# EAGLE design BI16_short (EAGLE 7.5.0)

## Sheet 1 of 2
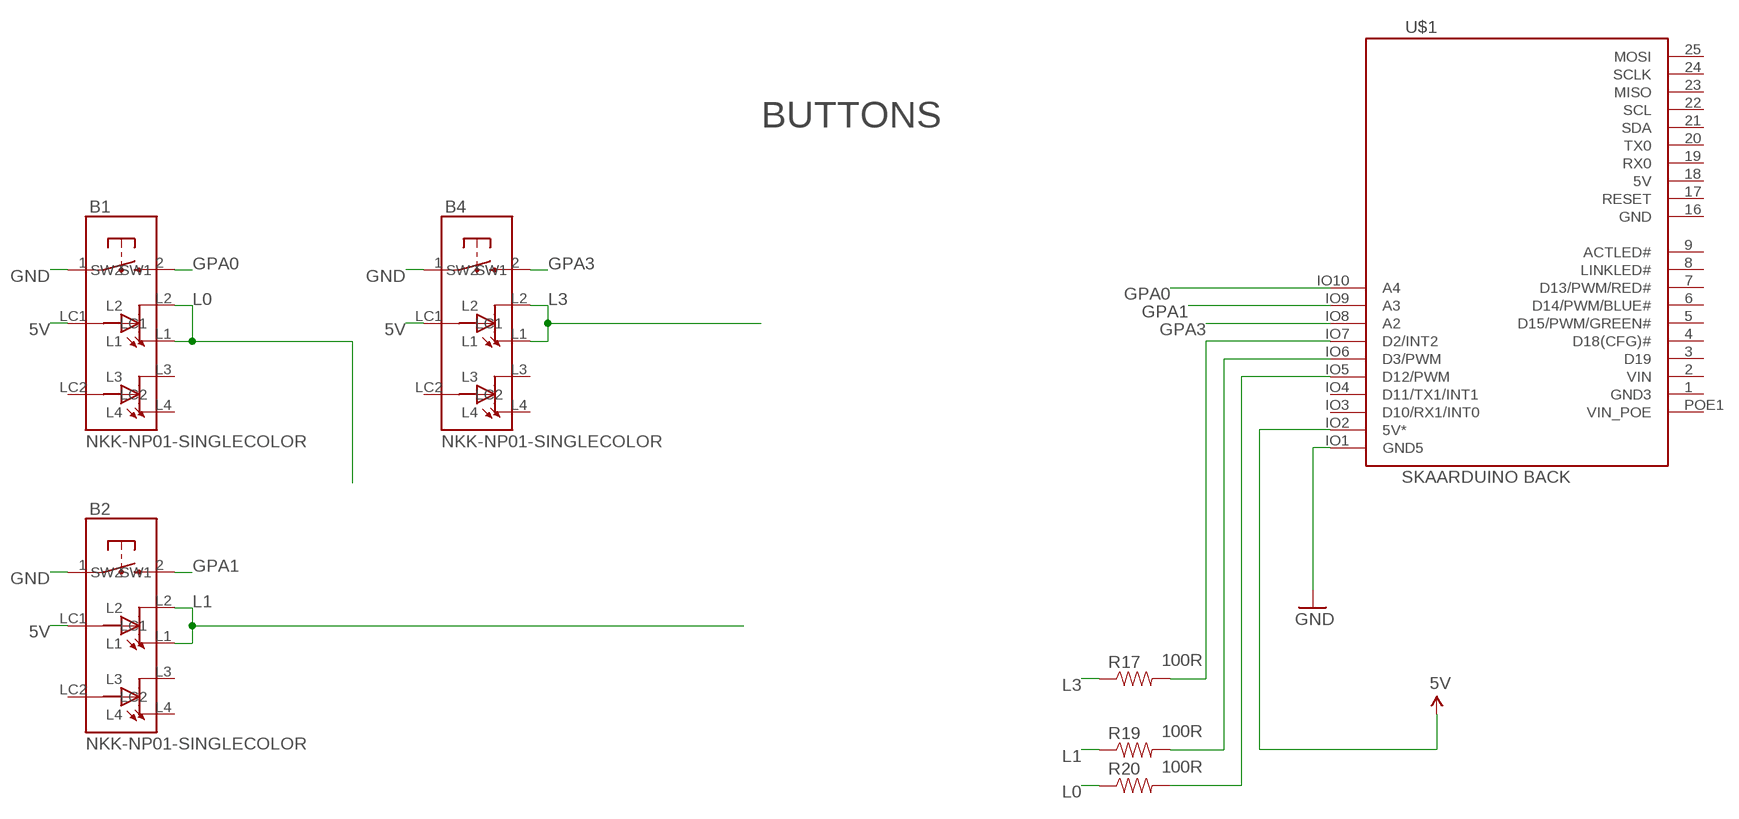
[diagram p0: schematic, sheet 1]

### Parts
B1  NKK-NP01-SINGLECOLOR  [NKK-NP01]
B2  NKK-NP01-SINGLECOLOR  [NKK-NP01]
B4  NKK-NP01-SINGLECOLOR  [NKK-NP01]
R17  100R  RESISTOR0603-RES  [0603-RES]
R19  100R  RESISTOR0603-RES  [0603-RES]
R20  100R  RESISTOR0603-RES  [0603-RES]
U$1  SKAARDUINO_BACK_EDGECON  [SKAARDUINO_BACK_PTH_EDGECON]

### Nets
5V [Power]: B1.LC1 B2.LC1 B4.LC1 U$1.IO2(5V*)
GND [Power]: B1.1(SW1) B2.1(SW1) B4.1(SW1) U$1.IO1(GND5)
GPA0: B1.2(SW2) U$1.IO10(A4)
GPA1: B2.2(SW2) U$1.IO9(A3)
GPA3: B4.2(SW2) U$1.IO8(A2)
L0: B1.L1 B1.L2 R20.1
L1: B2.L1 B2.L2 R19.1
L3: B4.L1 B4.L2 R17.1
N$10: R17.2 U$1.IO7(D2/INT2)
N$12: R19.2 U$1.IO6(D3/PWM)
N$19: R20.2 U$1.IO5(D12/PWM)
Unconnected: B1.L3 B1.L4 B1.LC2 B2.L3 B2.L4 B2.LC2 B4.L3 B4.L4 B4.LC2 U$1.3(D19) U$1.4(D18(CFG)#) U$1.5(D15/PWM/GREEN#) U$1.6(D14/PWM/BLUE#) U$1.7(D13/PWM/RED#) U$1.8(LINKLED#) U$1.9(ACTLED#) U$1.17(RESET) U$1.19(RX0) U$1.20(TX0) U$1.21(SDA) U$1.22(SCL) U$1.23(MISO) U$1.24(SCLK) U$1.25(MOSI) U$1.IO3(D10/RX1/INT0) U$1.IO4(D11/TX1/INT1)

### Notes on the sheet
- BUTTONS

## Sheet 2 of 2

## Power pins joined to a net without a drawn wire
5V: U$1.18(5V)
GND: U$1.16(GND)
GND3: U$1.1(GND3)
VIN: U$1.2(VIN)
VIN_POE: U$1.POE1(VIN_POE)

## Library data of the parts
B1 B2 B4 = SKAARHOJ:NKK-NP01-SINGLECOLOR
R17 R19 R20 = SparkFun:RESISTOR: Resistor Basic schematic elements and footprints for 0603, 1206, and PTH resistors.
U$1 = SKAARHOJ:SKAARDUINO_BACK_EDGECON

## Net classes
0 default: width 0.203 mm, drill 0.305 mm, clearance 0.152 mm
1 Power: width 0.406 mm, drill 0.61 mm, clearance 0.203 mm

## Board
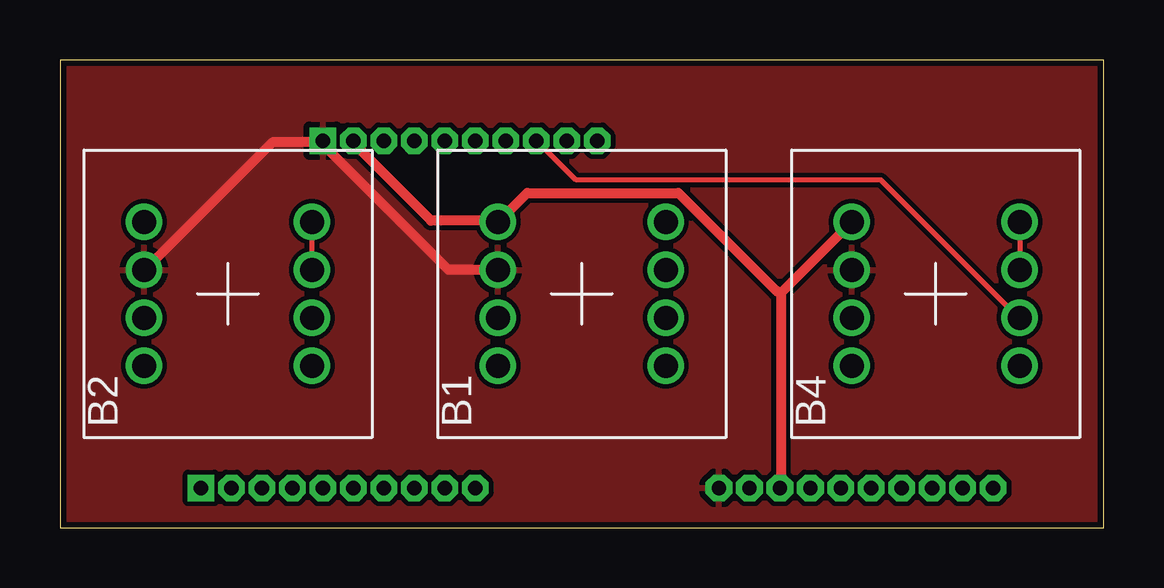
[diagram p1: board, top side]
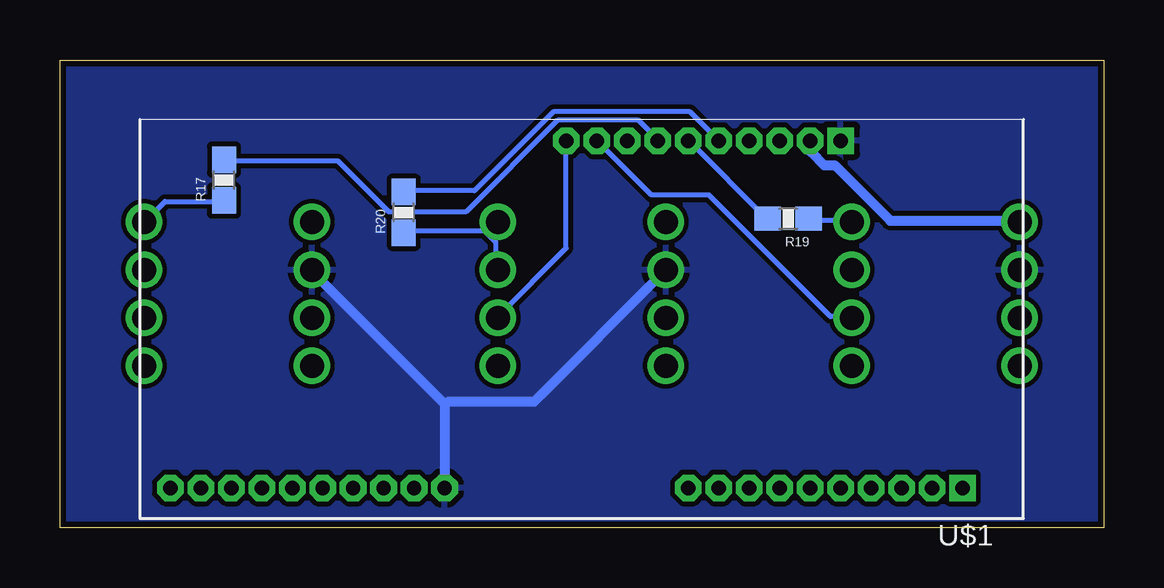
[diagram p2: board, bottom side, seen from below]

Size 43.5 x 19.5 mm. Coordinates in mm from the lower left corner, seen from the top.
Outline: 0,0 43.5,0 43.5,19.5 0,19.5 0,0
Copper layers (1*16): Top 0.035mm / dielectric 1.5mm / Bottom 0.035mm
Design rules "Fusion_eagle_rule_v1.1": minimum track width 6mil, minimum drill 12mil, track to track 6mil, track to pad 6mil, pad to pad 6mil, via to via 6mil, smd to smd 0mil, copper to edge 10mil, drill to drill 10mil, minimum pad ring 10mil, minimum via ring 6mil, stop-mask expansion 2mil, vias tented up to drill 100mil, thermal gap 10mil

### Footprints (pad centres in the part's own frame; a part is rotated, then mirrored left to right if it is on the bottom)
NKK-NP01 = drill 1: 1 1,3.5; 2 -1,-3.5; L1 3,-3.5; L2 1,-3.5; L3 -1,3.5; L4 -3,3.5; LC1 3,3.5; LC2 -3,-3.5
0603-RES = smd 1.1 x 1: 1 -0.85,0; 2 0.85,0
SKAARDUINO_BACK_PTH_EDGECON = drill 0.6 pad 1.016 octagon: 1 2.159,3.81; 2 2.159,5.08; 3 2.159,6.35; 4 2.159,7.62; 5 2.159,8.89; 6 2.159,10.16; 7 2.159,11.43; 8 2.159,12.7; 9 2.159,13.97; 16 2.159,24.13; 17 2.159,25.4; 18 2.159,26.67; 19 2.159,27.94; 20 2.159,29.21; 21 2.159,30.48; 22 2.159,31.75; 23 2.159,33.02; 24 2.159,34.29; 25 2.159,35.56; IO2 16.637,8.89; IO3 16.637,10.16; IO4 16.637,11.43; IO5 16.637,12.7; IO6 16.637,13.97; IO7 16.637,15.24; IO8 16.637,16.51; IO9 16.637,17.78; IO10 16.637,19.05 | drill 0.6 pad 1.016 square: IO1 16.637,7.62; POE1 2.159,2.54

### Placement (x,y rotation side)
B1  21.75,9.75 90 top
B2  7,9.75 90 top
B4  36.5,9.75 90 top
R17  36.66,14.49 90 bottom
R19  13.14,12.88 180 bottom
R20  29.17,13.14 90 bottom
U$1  3.34,-0.51 90 bottom

### Tracks (layer width: path | path; a pad name or v marks a point on that pad's centre or on a via)
5V
  Top 0.406: 30.05,9.78 30.05,1.69 U$1.18 | 30.05,9.78 32.98,12.71 B4.LC1 | U$1.IO2 12.54,15.82 12.54,15.73 15.47,12.8 18.22,12.8 B1.LC1 18.4,12.89 19.47,13.96 25.78,13.96 29.87,9.87 30.05,9.78
  Bottom 0.406: B2.LC1 3.56,12.8 8.89,12.8 11.2,15.11 11.65,15.11 12.18,15.65 12.18,16.09 U$1.IO2
GND
  Top 0.406: B2.1 3.56,10.76 8.89,16.09 10.94,16.09 U$1.IO1 11.02,15.91 16.18,10.76 18.22,10.76 B1.1
  Bottom 0.406: 27.47,5.16 U$1.16 | 27.47,5.16 32.98,10.67 B4.1 | 27.47,5.16 27.29,5.25 23.74,5.25 18.31,10.67 B1.1
  pour Top: 0,0 43.5,0 43.5,19.5 0,19.5
  pour Bottom: 0,0 43.5,0 43.5,19.5 0,19.5
GPA0
  Bottom 0.203: U$1.IO10 22.4,16.09 22.4,11.65 25.25,8.8 B1.2
GPA1
  Bottom 0.203: U$1.IO9 21.07,16.09 18.85,13.87 16.45,13.87 11.38,8.8 10.58,8.8 B2.2
GPA3
  Top 0.203: U$1.IO8 19.91,16.09 21.51,14.49 34.23,14.49 39.92,8.8 B4.2
L0
  Bottom 0.203: R20.1 29.16,12.36 25.69,12.36 25.34,12.71 B1.L1 25.69,12.27 25.34,11.91 25.34,10.76 B1.L2
L1
  Top 0.203: B2.L2 10.49,12.71 B2.L1
  Bottom 0.203: R19.1 12.27,12.8 10.58,12.8 B2.L1
L3
  Top 0.203: B4.L2 40.01,12.71 B4.L1
  Bottom 0.203: R17.1 36.72,13.6 39.12,13.6 39.92,12.8 B4.L1
N$10
  Bottom 0.203: R17.2 36.63,15.29 31.91,15.29 29.78,13.16 26.58,13.16 22.76,16.98 19.38,16.98 18.58,16.18 U$1.IO7
N$12
  Bottom 0.203: R19.2 14.05,12.89 17.25,16.09 U$1.IO6
N$19
  Bottom 0.203: U$1.IO5 17.25,17.34 22.94,17.34 26.23,14.05 29.16,14.05 R20.2